# EAGLE design SKAARDUINO_v3.1_bottom (EAGLE 7.5.0)
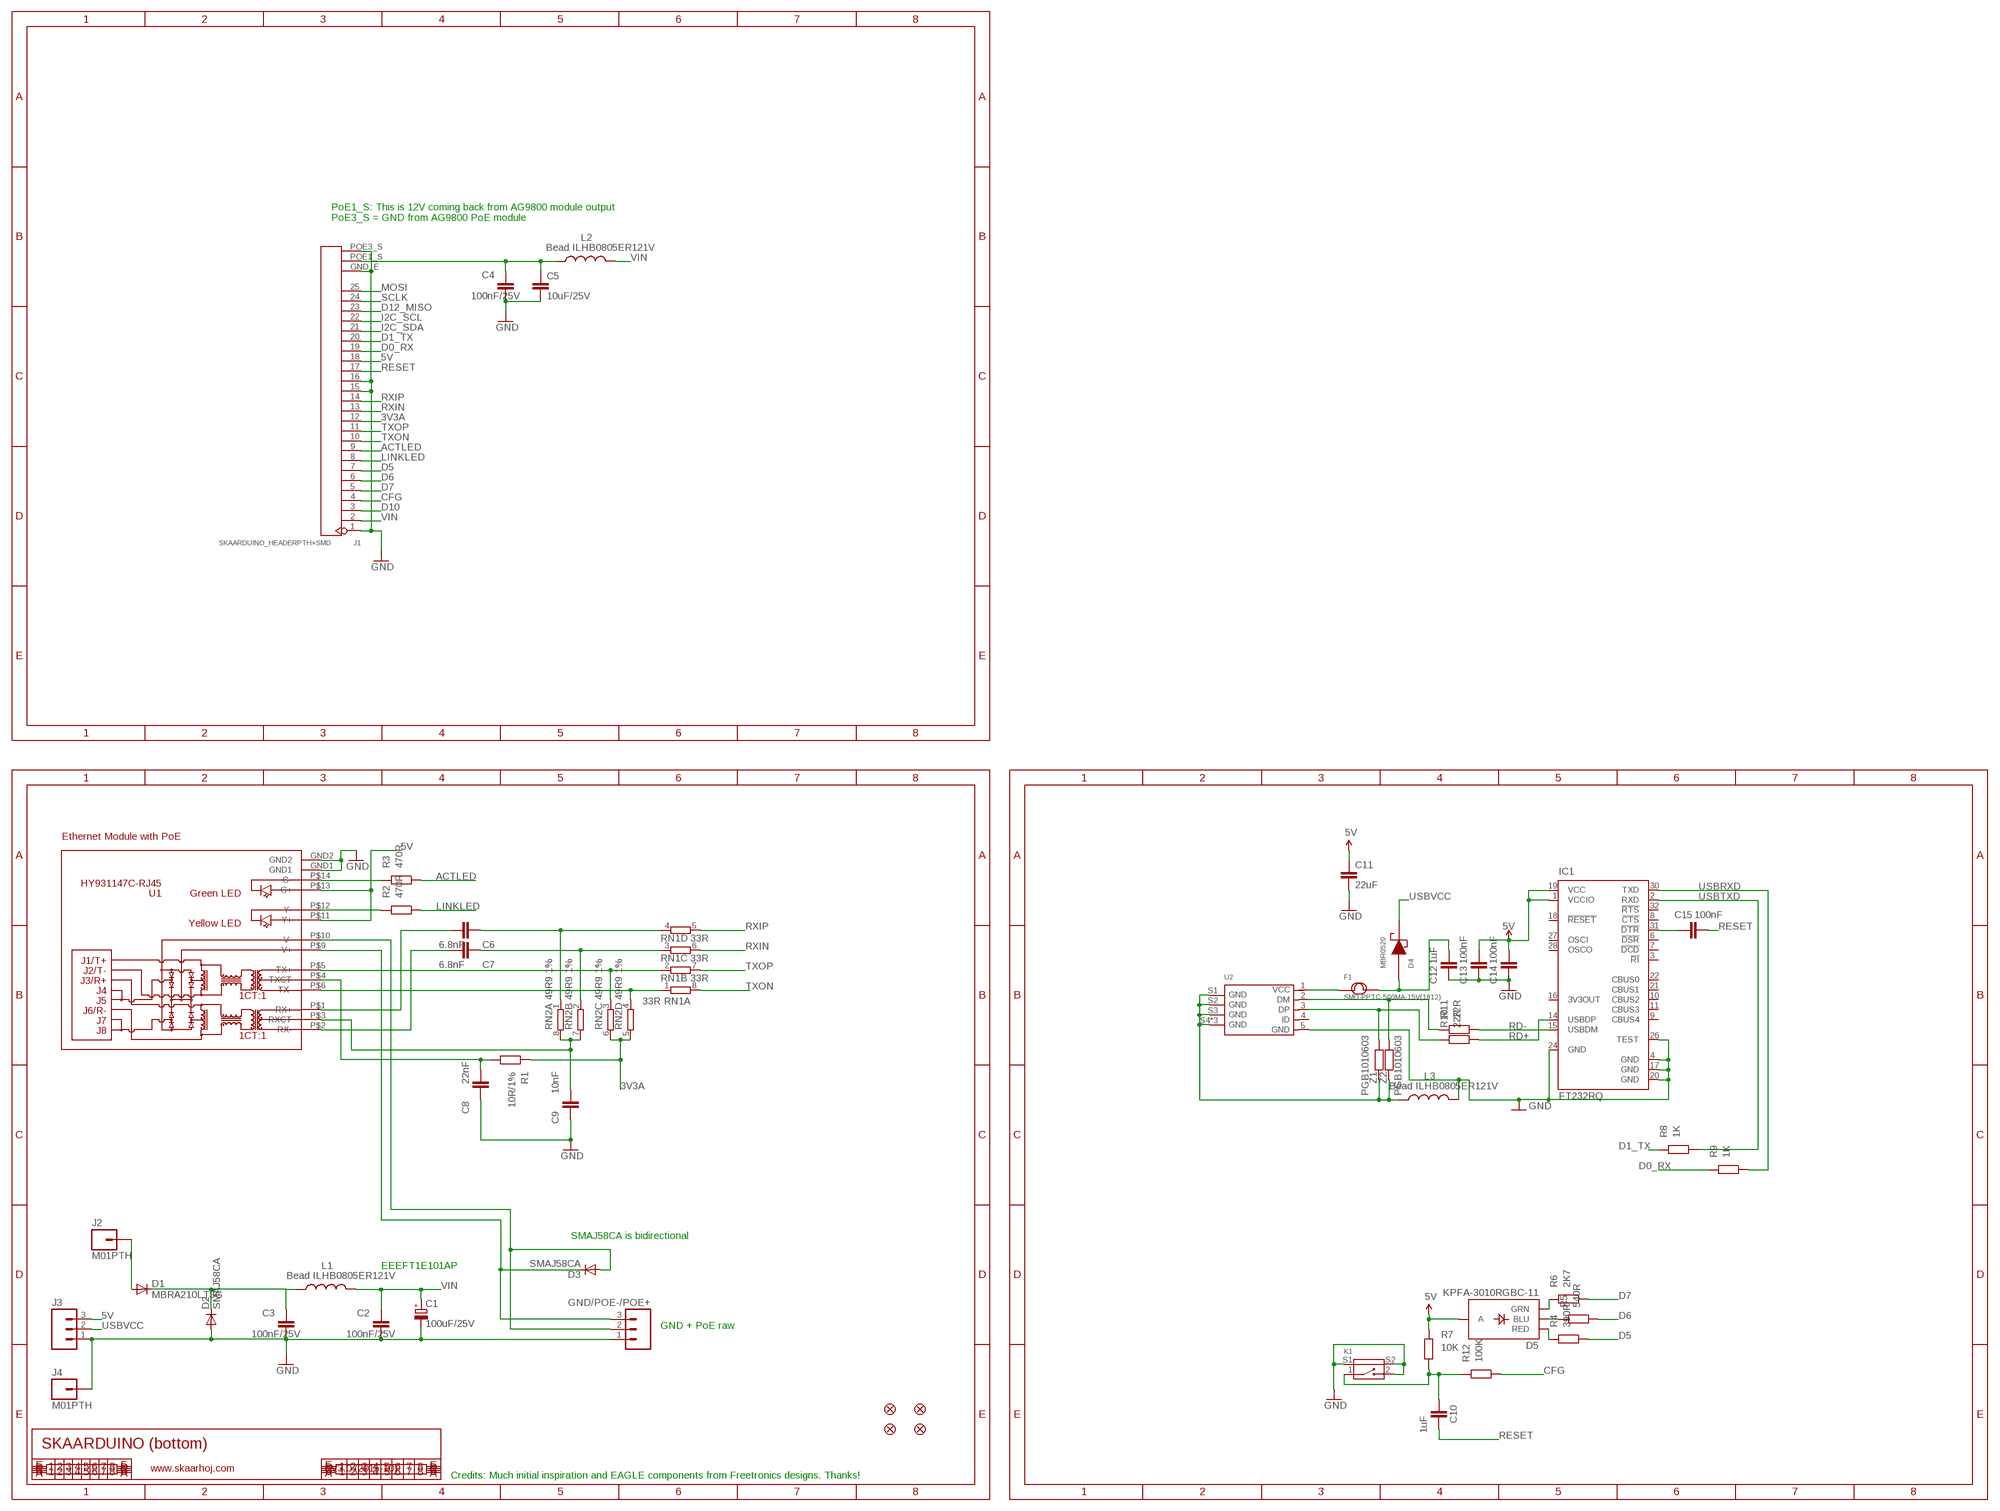
[diagram p0: schematic, sheet 1]

## Parts
C1  100uF/25V  CPOL-EUD  [PANASONIC_D]
C2  100nF/25V  CAP0402  [C0402]
C3  100nF/25V  CAP0402  [C0402]
C4  100nF/25V  CAP0402  [C0402]
C5  10uF/25V  CAP0805  [0805]
C6  6.8nF  C-EU0402C  [0402C]
C7  6.8nF  C-EU0402C  [0402C]
C8  22nF  C-EU0402C  [0402C]
C9  10nF  C-EU0402C  [0402C]
C10  1uF  C-EU0402C  [0402C]
C11  22uF  CAP0805  [0805]
C12  1uF  C-EU0402C  [0402C]
C13  100nF  C-EU0402C  [0402C]
C14  100nF  C-EU0402C  [0402C]
C15  100nF  C-EU0402C  [0402C]
D1  MBRA210LT3G  DIODESMA  [SMA-DIODE]
D2  SMAJ58CA  DIODESMA  [SMA-DIODE]
D3  SMAJ58CA  DIODESMA  [SMA-DIODE]
D4  MBR0520  [SOD-123]
D5  KPFA-3010RGBC-11  LED-TRICOLOR  [LED-TRICOLOR-SMD]
F1  SMD-PPTC-500MA-15V(1812)  [F1812]
FID1  FIDUCIAL1X2.5  [FIDUCIAL-1X2.5]
FID2  FIDUCIAL1X2.5  [FIDUCIAL-1X2.5]
FID3  FIDUCIAL1X2.5  [FIDUCIAL-1X2.5]
FID4  FIDUCIAL1X2.5  [FIDUCIAL-1X2.5]
GND/POE-/POE+  M03LOCK  [1X03_LOCK]
IC1  FT232RQ  [QFN32]
J1  SKAARDUINO_HEADERPTH+SMD  [SKAARDUINO_PTH_SMD_HEADER]
J2  M01PTH  [1X01]
J3  M03LOCK  [1X03_LOCK]
J4  M01PTH  [1X01]
K1  SMD-BUTTON-2+2P  [SW4-SMD-7.0X3.5X3.5MM-90D]
L1  Bead ILHB0805ER121V  L-USL2012C  [L2012C]
L2  Bead ILHB0805ER121V  L-USL2012C  [L2012C]
L3  Bead ILHB0805ER121V  L-USL2012C  [L2012C]
R1  10R/1%  RESISTOR0402  [0402]
R2  470R  RESISTOR0402  [0402]
R3  470R  RESISTOR0402  [0402]
R4  390R  RESISTOR0402  [0402]
R5  540R  RESISTOR0402  [0402]
R6  2K7  RESISTOR0402  [0402]
R7  10K  RESISTOR0402  [0402]
R8  1K  RESISTOR0402  [0402]
R9  1K  RESISTOR0402  [0402]
R10  22R  RESISTOR0402  [0402]
R11  22R  RESISTOR0402  [0402]
R12  100K  RESISTOR0402  [0402]
RN1  33R  4R-NCAY16  [CAY16]
RN2  49R9 1%  4R-NCAY16  [CAY16]
U1  HY931147C-RJ45  [HY931147C]
U2  MICRO-USB-SMD-B-WITHOUT-POST-W/P(ST-USB-001G)  [MICRO-USB5+4P-SMD-0.65-B]
Z1  PGB1010603  RESISTOR0402  [C0402]
Z2  PGB1010603  RESISTOR0402  [C0402]

## Nets
3V3A: J1.12 R1.2 RN2.5 RN2.6
5V [power]: C11.1 C13.2 C14.2 D5.A IC1.1(VCCIO) IC1.19(VCC) J1.18 J3.3 R7.2 U1.P$11(Y+) U1.P$13(G+)
ACTLED: J1.9 R3.1
CFG: J1.4 R12.1
CFGSW: C10.2 K1.1 R7.1 R12.2
D0_RX: J1.19 R9.2
D1_TX: J1.20 R8.2
D5: J1.7 R4.1
D6: J1.6 R5.1
D7: J1.5 R6.1
D10: J1.3
D12_MISO: J1.23
GND [power]: C1.- C2.2 C3.2 C4.2 C5.2 C8.1 C9.1 C11.2 C12.1 C13.1 C14.1 D2.A GND/POE-/POE+.1 IC1.4(GND) IC1.17(GND) IC1.20(GND) IC1.24(GND) IC1.26(TEST) J1.1 J1.15 J1.16 J1.GND_E J1.POE3_S J3.1 J4.1 K1.2 K1.S1 K1.S2 L3.2 U1.GND1 U1.GND2 U2.5(GND)
I2C_SCL: J1.22
I2C_SDA: J1.21
LINKLED: J1.8 R2.1
MOSI: J1.25
N$1: C8.2 R1.1 U1.P$4(TXCT)
N$2 [VIN]: C4.1 C5.1 J1.POE1_S L2.1
N$3 [VIN]: D3.C GND/POE-/POE+.3 U1.P$9(V+)
N$4 [VIN]: C3.1 D1.C D2.C L1.1
N$5 [VIN]: D3.A GND/POE-/POE+.2 U1.P$10(V-)
N$6 [VIN]: C12.2 D4.2(AN) F1.2
N$7 [VIN]: F1.1 U2.1(VCC)
N$9: C7.2 U1.P$2(RX-)
N$10: D5.G(GRN) R6.2
N$11: C6.2 U1.P$1(RX+)
N$13 [VIN]: D1.A J2.1
N$14: D5.B(BLU) R5.2
N$15: D5.R(RED) R4.2
N$16: R10.2 U2.3(DP) Z1.1
N$17: R11.2 U2.2(DM) Z2.1
N$18: C15.1 IC1.31(!DTR)
N$21: L3.1 U2.S1(GND) U2.S2(GND) U2.S3(GND) U2.S4(GND) U2.S5(GND) U2.S6(GND) Z1.2 Z2.2
N$67: R3.2 U1.P$14(G-)
N$321: C9.2 RN2.7 RN2.8 U1.P$3(RXCT)
N$332: R2.2 U1.P$12(Y-)
RD+: IC1.14(USBDP) R10.1
RD-: IC1.15(USBDM) R11.1
RESET: C10.1 C15.2 J1.17
RXIN: J1.13 RN1.6
RXIN_E: C7.1 RN1.3 RN2.2
RXIP: J1.14 RN1.5
RXIP_E: C6.1 RN1.4 RN2.1
SCLK: J1.24
TXON: J1.10 RN1.8
TXON_E: RN1.1 RN2.4 U1.P$6(TX-)
TXOP: J1.11 RN1.7
TXOP_E: RN1.2 RN2.3 U1.P$5(TX+)
USBRXD: IC1.30(TXD) R9.1
USBTXD: IC1.2(RXD) R8.1
USBVCC [VIN]: D4.1(CA) J3.2
VIN [VIN]: C1.+ C2.1 J1.2 L1.2 L2.2
Unconnected: IC1.3(!RI) IC1.6(!DSR) IC1.7(!DCD) IC1.8(!CTS) IC1.9(CBUS4) IC1.10(CBUS2) IC1.11(CBUS3) IC1.16(3V3OUT) IC1.18(!RESET) IC1.21(CBUS1) IC1.22(CBUS0) IC1.27(OSCI) IC1.28(OSCO) IC1.32(!RTS) U2.4(ID)

## Notes on the sheet
- PoE1_S: This is 12V coming back from AG9800 module output
  PoE3_S = GND from AG9800 PoE module
- Ethernet Module with PoE
- SMAJ58CA is bidirectional
- EEEFT1E101AP
- GND + PoE raw
- SKAARDUINO (bottom)
- www.skaarhoj.com | V3.0 (2015-10)
- Credits: Much initial inspiration and EAGLE components from Freetronics designs. Thanks!

## Library data of the parts
C1 = rcl:CPOL-EU: POLARIZED CAPACITOR, European symbol
C2-C4 = freetronics:CAP: Capacitor Standard 0603 ceramic capacitor, and 0.1" leaded capacitor.
C5 C11 = SparkFun:CAP: Capacitor Standard 0603 ceramic capacitor, and 0.1" leaded capacitor.
C6-C10 C12-C15 = freetronics-jon:C-EU: CAPACITOR, European symbol
D1-D3 = SparkFun:DIODE: Diode These are standard reverse protection diodes and small signal diodes. SMA package can handle up to about 1A. SOD-323 can handle about 200mA. What the SOD-323 package when ordering, there are some mfgs out there that are 5-pin packages.
D4 = MySMD:MBR0520
D5 = SKAARHOJ:LED-TRICOLOR: Tri-Color LED SMD Proven layout and schematic for triple color LED in SMD package - common anode. Spark Fun Electronics SKU : COM-07844
F1 = Seeed-OPL-fuse:SMD-PPTC-500MA-15V(1812): 307010007
FID1-FID4 = freetronics:FIDUCIAL: Fiducial Alignment Points Various fiducial points for machine vision alignment.
GND/POE-/POE+ J3 = SparkFun:M03: Header 3 Standard 3-pin 0.1" header. Use with straight break away headers (SKU : PRT-00116), right angle break away headers (PRT-00553), swiss pins (PRT-00743), machine pins (PRT-00117), and female headers (PRT-00115). Molex polarized connector foot print use with SKU : PRT-08232 with associated crimp pins and housings.
IC1 = ftdichip:FT232R: Source: http://www.ftdichip.com/Documents/DataSheets/DS_FT232R_v104.pdf; MPN: FT232RQ; OC_FARNELL: 1146033; OC_NEWARK: 91K9919
J1 = SKAARHOJ:SKAARDUINO_HEADER
J2 J4 = SparkFun:M01: Header 1 Standard 1-pin 0.1" header. Use with straight break away headers (SKU : PRT-00116), right angle break away headers (PRT-00553), swiss pins (PRT-00743), machine pins (PRT-00117), and female headers (PRT-00115).
K1 = Seeed-OPL-Button:SMD-BUTTON-2+2P: 311020023; MPN: TS-1188E
L1-L3 = rcl:L-US: INDUCTOR, American symbol
R1-R12 = freetronics-jon:RESISTOR: Resistor Basic schematic elements and footprints for 0603, 1206, and PTH 1/10th watt (small) resistors.
RN1 RN2 = freetronics-master-v1:4R-N: Array Chip Resistor Source: RS Component / Phycomp
U1 = freetronics-jon:HY931147C
U2 = Seeed-OPL-Connector:MICRO-USB-SMD-B-WITHOUT-POST-W/P(ST-USB-001G): 320010000; MPN: ST-USB-001G
Z1 Z2 = freetronics:RESISTOR: Resistor Basic schematic elements and footprints for 0603, 1206, and PTH 1/10th watt (small) resistors.

## Net classes
0 default: width 0.203 mm, clearance 0.127 mm
1 power: width 0.203 mm, clearance 0.127 mm
2 VIN: width 0.406 mm, clearance 0.61 mm

## Board
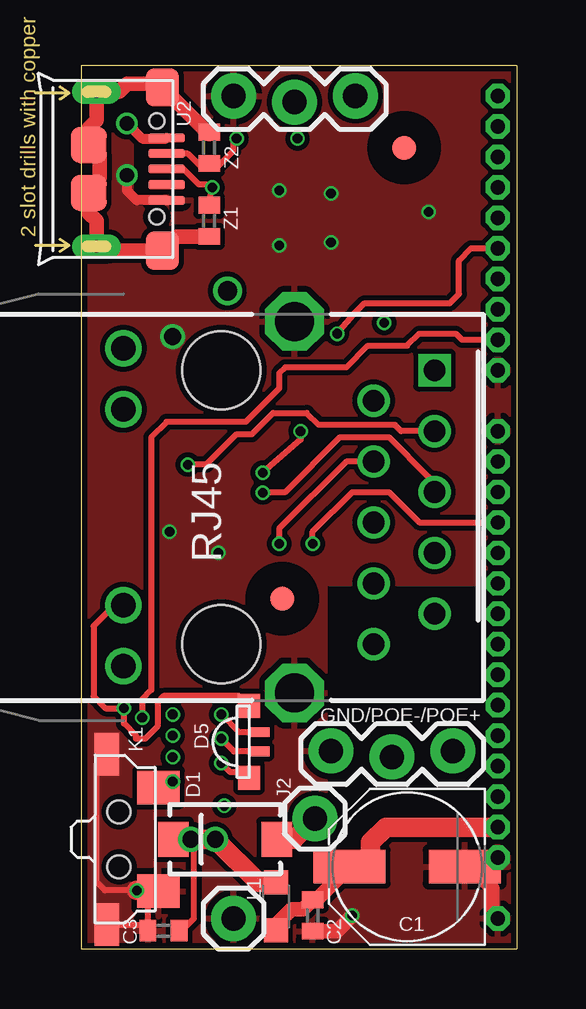
[diagram p1: board, top side]
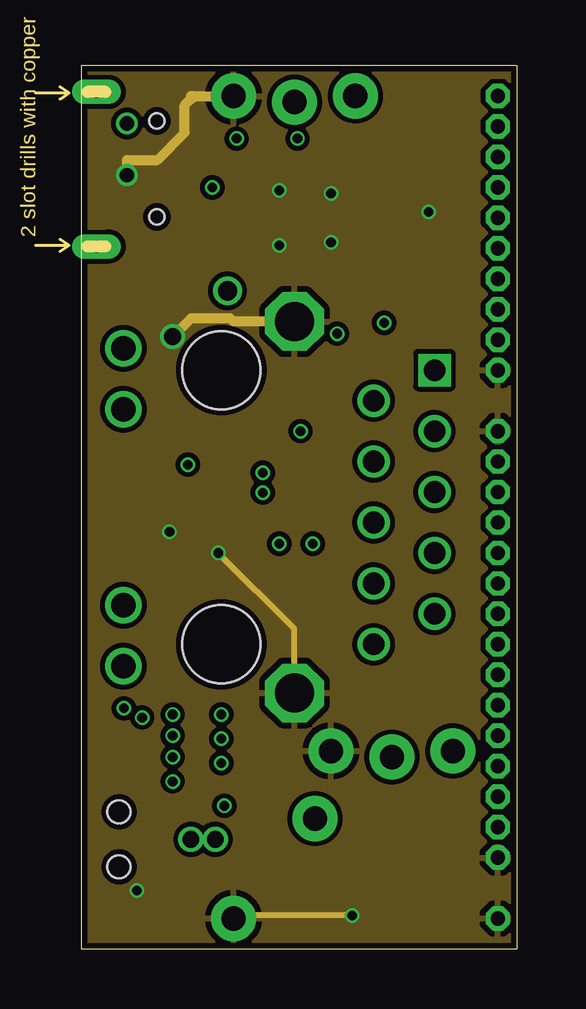
[diagram p2: board, inner layer GND]
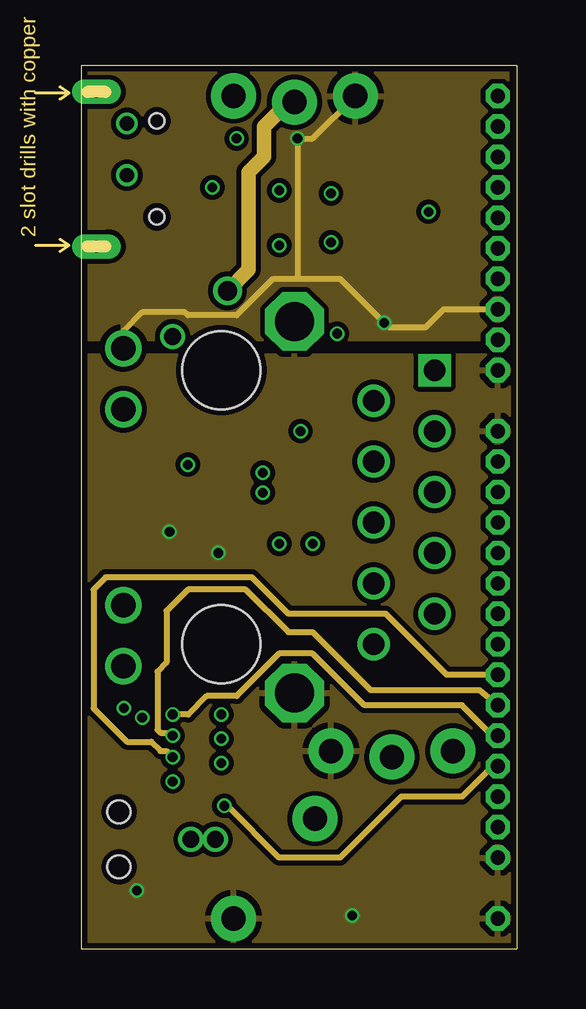
[diagram p3: board, inner layer 5V]
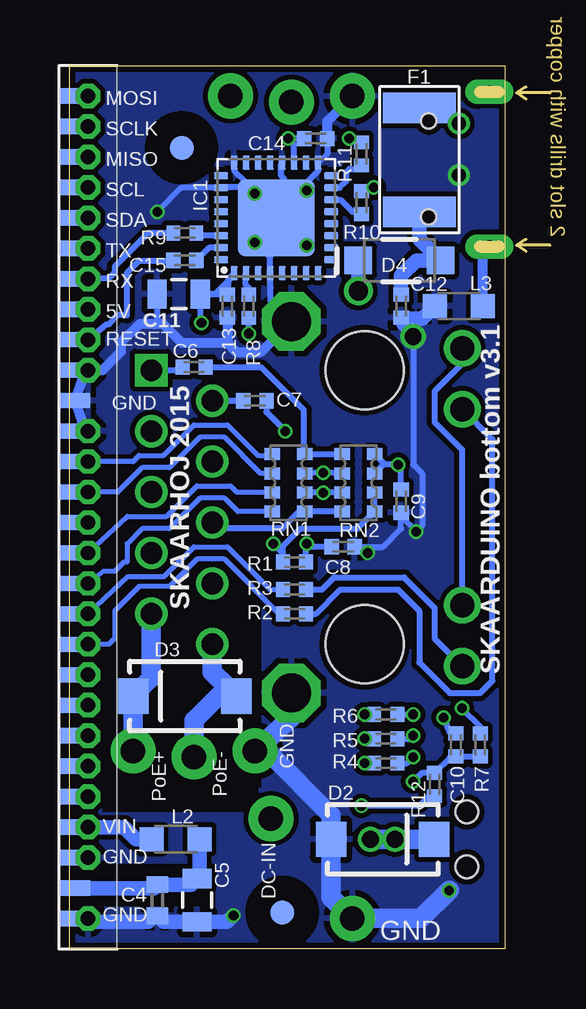
[diagram p4: board, bottom side, seen from below]

Size 18.16 x 36.83 mm. Coordinates in mm from the lower left corner, seen from the top.
Outline: 0,0 18.16,0 18.16,36.83 0,36.83 0,0
Copper layers (1*2*15*16): Top 0.035mm / dielectric 0.2mm / GND 0.0175mm / dielectric 0.3mm / 5V 0.0175mm / dielectric 0.2mm / Bottom 0.035mm
Design rules "SeeedStudio_4layer_DRU_no_angle_20140221 *": minimum track width 8mil, minimum drill 12mil, track to track 8mil, track to pad 8mil, pad to pad 8mil, via to via 8mil, smd to smd 0mil, copper to edge 10mil, drill to drill 8mil, minimum pad ring 6mil, minimum via ring 4mil, stop-mask expansion 4mil, vias tented up to drill 100mil, thermal gap 10mil
tRestrict: area 7.4,13.6 to 9.4,15.6; area 12.4,32.4 to 14.5,34.4; area 10.3,5.8 to 18.2,15.1
bRestrict: area 12.4,32.4 to 14.5,34.4; area 8.3,0.5 to 10.3,2.5; area 12.1,1.8 to 18,3.6; area 10.2,6.7 to 16.8,14.9; area 10.3,5.7 to 16.8,6.9
vRestrict: area 10.2,5.8 to 18,15.1

### Footprints (pad centres in the part's own frame; a part is rotated, then mirrored left to right if it is on the bottom)
PANASONIC_D = smd 3 x 1.4: + 2.4,0; - -2.4,0
C0402 = smd 0.7 x 0.9: 1 -0.65,0; 2 0.65,0
0805 = smd 0.8 x 1.2: 1 -0.9,0; 2 0.9,0
0402C = smd 0.59 x 0.64: 1 -0.48,0; 2 0.48,0
SMA-DIODE = smd 1.27 x 1.47: A -2.15,0; C 2.15,0
SOD-123 = smd 1.143 x 1.143: 1 0,0; 2 3.429,0
LED-TRICOLOR-SMD = smd 1 x 0.9: A -1.5,0; R 1.5,0 | smd 0.4 x 0.8: B 0.4,0.45; G -0.4,0.45
F1812 = smd 1.27 x 3.048: 1 -2.159,0; 2 2.159,0
FIDUCIAL-1X2.5 = smd 1 x 1: 1 0,0
1X03_LOCK = drill 1.016 pad 1.88: 1 0,0.127; 2 2.54,-0.127; 3 5.08,0.127
QFN32 = smd 0.6 x 0.3: 1 -2.3,1.75; 2 -2.3,1.25; 3 -2.3,0.75; 4 -2.3,0.25; 5 -2.3,-0.25; 6 -2.3,-0.75; 7 -2.3,-1.25; 8 -2.3,-1.75; 17 2.3,-1.75; 18 2.3,-1.25; 19 2.3,-0.75; 20 2.3,-0.25; 21 2.3,0.25; 22 2.3,0.75; 23 2.3,1.25; 24 2.3,1.75 | smd 0.3 x 0.6: 9 -1.75,-2.3; 10 -1.25,-2.3; 11 -0.75,-2.3; 12 -0.25,-2.3; 13 0.25,-2.3; 14 0.75,-2.3; 15 1.25,-2.3; 16 1.75,-2.3; 25 1.75,2.3; 26 1.25,2.3; 27 0.75,2.3; 28 0.25,2.3; 29 -0.25,2.3; 30 -0.75,2.3; 31 -1.25,2.3; 32 -1.75,2.3 | smd 3.2 x 3.2: EXP 0,0
SKAARDUINO_PTH_SMD_HEADER = drill 0.6 pad 1.016 octagon: 1 0.79,3.81; 2 0.79,5.08; 3 0.79,6.35; 4 0.79,7.62; 5 0.79,8.89; 6 0.79,10.16; 7 0.79,11.43; 8 0.79,12.7; 9 0.79,13.97; 10 0.79,15.24; 11 0.79,16.51; 12 0.79,17.78; 13 0.79,19.05; 14 0.79,20.32; 15 0.79,21.59; 16 0.79,24.13; 17 0.79,25.4; 18 0.79,26.67; 19 0.79,27.94; 20 0.79,29.21; 21 0.79,30.48; 22 0.79,31.75; 23 0.79,33.02; 24 0.79,34.29; 25 0.79,35.56; GND_E 0.79,1.27 | smd 1.27 x 0.635: GND_E2 0.254,1.27; P$1 0.254,3.81; P$2 0.254,5.08; P$3 0.254,6.35; P$4 0.254,7.62; P$5 0.254,8.89; P$6 0.254,10.16; P$7 0.254,11.43; P$8 0.254,12.7; P$9 0.254,13.97; P$10 0.254,15.24; P$11 0.254,16.51; P$12 0.254,17.78; P$13 0.254,19.05; P$14 0.254,20.32; P$15 0.254,21.59; P$16 0.254,24.13; P$17 0.254,25.4; P$18 0.254,26.67; P$19 0.254,27.94; P$20 0.254,29.21; P$21 0.254,30.48; P$22 0.254,31.75; P$23 0.254,33.02; P$24 0.254,34.29; P$25 0.254,35.56; POE1_S 0.254,2.54; POE3_S 0.254,22.86
1X01 = drill 1.016 pad 1.88: 1 0,0
SW4-SMD-7.0X3.5X3.5MM-90D = smd 1.397 x 1.778: 1 -2.159,1.651; 2 2.159,1.651 | smd 1.778 x 1.016: S1 -3.556,-0.508; S2 3.556,-0.508 | hole 0.95: -1.15,0; 1.15,0
L2012C = smd 1 x 1: 1 -1,0; 2 1,0
0402 = smd 0.571 x 0.62: 1 -0.48,0; 2 0.48,0
CAY16 = smd 0.5 x 0.65: 1 -1.2,-0.675; 2 -0.4,-0.675; 3 0.4,-0.675; 4 1.2,-0.675; 5 1.2,0.675; 6 0.4,0.675; 7 -0.4,0.675; 8 -1.2,0.675
HY931147C = drill 1.63 octagon: GND1 3.05,7.745; GND2 3.05,-7.745 | drill 0.9 square: P$1 8.89,5.715 | drill 0.9: P$2 6.35,4.445; P$3 8.89,3.175; P$4 6.35,1.905; P$5 8.89,0.635; P$6 6.35,-0.635; P$7 8.89,-1.905; P$8 6.35,-3.175; P$9 8.89,-4.445; P$10 6.35,-5.715 | drill 1.016: P$11 -4.08,6.625; P$12 -4.08,4.085; P$13 -4.08,-4.085; P$14 -4.08,-6.625 | hole 3.25: 0,5.715; 0,-5.715
MICRO-USB5+4P-SMD-0.65-B = smd 0.381 x 1.524: 1 -1.3,-0.25; 2 -0.65,-0.25; 3 0,-0.25; 4 0.65,-0.25; 5 1.3,-0.25 | smd 1.6 x 1.397: S1 -3.4,-0.427; S6 3.4,-0.427 | drill 0.508 pad 1.016 long: S2 -3.226,-3.175; S5 3.226,-3.175 | smd 1.5 x 1.5: S3 -1,-3.5; S4 1,-3.5 | hole 0.635: -2,-0.65; 2,-0.65

### Placement (x,y rotation side)
C1  13.59,3.43 180 top
C2  9.65,1.4 270 top
C3  3.43,0.76 180 top
C4  14.48,2.03 270 bottom
C5  12.83,2.03 270 bottom
C6  12.95,24.26 180 bottom
C7  10.41,22.86 180 bottom
C8  6.73,16.76 180 bottom
C9  4.32,18.67 90 bottom
C10  2.03,8.51 270 bottom
C11  13.59,27.3 180 bottom
C12  4.32,26.8 90 bottom
C13  11.56,26.8 90 bottom
C14  7.87,33.78 180 bottom
C15  13.34,28.7 180 bottom
D1  6,4.57 180 top
D2  5.08,4.57 0 bottom
D3  13.34,10.54 180 bottom
D4  6.1,28.7 0 bottom
D5  7,8.64 270 top
F1  3.56,32.89 270 bottom
FID1  8.38,14.61 0 top
FID2  9.27,1.52 0 bottom
FID3  13.46,33.4 0 top
FID4  13.46,33.4 0 bottom
GND/POE-/POE+  10.41,8.13 0 top
IC1  9.53,30.48 90 bottom
J1  18.16,0 0 bottom
J2  9.74,5.44 0 top
J3  6.35,35.43 0 top
J4  6.35,1.27 0 top
K1  1.57,4.57 270 top
L1  8.13,1.78 270 top
L2  13.72,4.57 180 bottom
L3  1.91,26.8 180 bottom
R1  8.76,16.13 180 bottom
R2  8.76,13.97 0 bottom
R3  8.76,14.99 0 bottom
R4  4.95,7.75 180 bottom
R5  4.95,8.76 180 bottom
R6  4.95,9.78 180 bottom
R7  1.02,8.51 90 bottom
R8  10.67,26.8 270 bottom
R9  13.34,29.84 180 bottom
R10  5.97,31.11 90 bottom
R11  5.97,33.15 90 bottom
R12  2.92,6.86 90 bottom
RN1  9.02,19.43 90 bottom
RN2  6.1,19.43 270 bottom
U1  5.84,18.41 0 top
U2  3.81,32.51 270 top
Z1  5.33,30.35 270 top
Z2  5.33,33.4 90 top

### Tracks (layer width: path | path; a pad name or v marks a point on that pad's centre or on a via)
3V3A  (via drill 0.4)
  Top 0.254: v9.65,16.89 9.65,17.4 11.3,19.05 12.83,19.05 14.1,17.78 J1.12
  Bottom 0.254: RN2.6 RN2.5 6.13,17.53 8.51,17.53 9.24,16.79 R1.2 9.24,16.48 v9.65,16.89
5V  (via drill 0.4)
  Top 0.254: D5.A 6.59,10.54 3.43,10.54 3.17,10.29 3.17,9.27 2.67,8.76 2.29,8.76 2.29,8.89 1.78,9.4 v1.78,10.03 1.02,10.03 0.51,10.54 0.51,13.46 1.38,14.33 U1.P$13
  5V 0.254: 9.02,27.94 8,27.94 6.48,26.42 4.45,26.42 4.32,26.54 2.54,26.54 1.76,25.77 U1.P$11 | 9.02,27.94 10.79,27.94 v12.64,26.1 12.83,25.91 14.35,25.91 15.11,26.67 J1.18 | 9.02,27.94 v9.02,33.78 9.65,33.78 J3.3
  Bottom 0.254: R7.2 1.02,9.27 v1.78,10.03 | C14.2 v9.02,33.78 8.78,33.54 IC1.19 | U1.P$11 1.76,24.4 2.92,23.24 2.92,21.97 1.78,20.83 1.78,14.35 U1.P$13 | C11.1 12.66,27.28 C13.2 11.53,27.94 IC1.1 11.28,28.09 12.06,27.3 C11.1 12.7,26.16 v12.64,26.1
  pour 5V: 0,36.83 17.78,36.83 17.78,25.4 0,25.4
ACTLED
  Bottom 0.203: R3.1 9.78,14.99 11.56,16.76 12.95,16.76 14.2,15.52 15.7,15.52 J1.9
CFG  (via drill 0.4)
  5V 0.254: J1.4 17.14,7.62 15.88,6.35 13.34,6.35 10.79,3.81 8.26,3.81 6.1,5.97 v5.97,5.97
  Bottom 0.254: R12.1 3.15,6.38 3.56,5.97 v5.97,5.97
CFGSW  (via drill 0.4)
  Top 0.254: v3.81,6.99 3.48,6.99 K1.1
  Bottom 0.254: R7.1 C10.2 2.09,7.97 2.29,7.97 R12.2 3.46,7.34 v3.81,6.99
D0_RX
  Bottom 0.254: R9.2 14.86,29.84 16.26,28.45 16.26,28.19 16.51,27.94 J1.19
D1_TX  (via drill 0.4)
  Top 0.254: v10.67,25.65 11.43,26.54 11.81,26.92 15.37,26.92 15.75,27.3 15.75,28.7 16.26,29.21 J1.20
  Bottom 0.254: R8.2 v10.67,25.65
D5  (via drill 0.4)
  5V 0.254: v3.81,8 3.56,8.26 3.3,8.26 2.92,8.64 1.91,8.64 0.51,10.03 0.51,14.99 1.02,15.49 7.11,15.49 8.64,13.97 12.7,13.97 15.24,11.43 J1.7
  Bottom 0.254: R4.1 4.06,7.75 v3.81,8
D6  (via drill 0.4)
  5V 0.254: v3.81,8.89 3.68,9.02 3.3,9.02 3.17,9.14 3.17,11.56 3.56,11.94 3.56,14.1 4.45,14.99 6.86,14.99 8.64,13.21 9.65,13.21 12.06,10.79 16.61,10.79 J1.6
  Bottom 0.254: R5.1 3.94,8.76 v3.81,8.89
D7  (via drill 0.4)
  5V 0.254: v3.81,9.78 R6.1 5.24,10.54 6.48,10.54 8.26,12.32 9.65,12.32 11.81,10.16 15.88,10.16 17.14,8.89 J1.5
  Bottom 0.254: R6.1 4.35,9.65 4.35,9.75 4.32,9.78 v3.81,9.78
GND  (via drill 0.4, 0.6, 0.7)
  Top 0.254: K1.S2 2.52,1.02 C3.2 2.78,1.97 | 2.78,1.97 K1.2 | 2.78,1.97 v2.31,2.44 0.99,2.44 0.64,2.79 0.64,7.7 K1.S1
  Top 0.406: U2.5 2.32,31.21 1.91,31.62 v1.91,32.26
  Top 0.61: C2.2 10.65,0.75 v11.3,1.4 | J1.1 16.86,3.43 C1.- 16.37,3.31 17.14,2.54 17.14,1.37 J1.GND_E
  Top 0.813: v2.31,2.44 3.2,2.44 K1.2
  GND 0.254: U1.GND2 8.89,13.33 v5.71,16.51 | v11.3,1.4 6.48,1.4 J4.1
  GND 0.406: v1.91,32.26 1.91,32.89 3.17,32.89 4.32,34.04 4.32,35.18 4.7,35.56 | 4.57,35.56 4.7,35.56 | 4.7,35.56 J3.1 | U1.GND1 6.35,26.16 6.22,26.29 4.57,26.29 v3.81,25.53
  Bottom 0.254: 4.42,18.16 C9.1 | v5.71,16.51 5.71,16.74 C8.1 5.08,16.76 4.32,17.53 C9.1 | v14.48,30.73 13.48,31.73 IC1.26 11.8,31.75 10.62,31.75 | C14.1 7.39,33.16 IC1.17 7.78,32.43 8.33,31.88 | 8.33,31.88 9.17,31.88 9.2,31.9 | 9.2,31.9 9.2,32.11 9.32,32.23 9.32,32.73 IC1.20 | IC1.24 11.28,32.43 10.82,31.98 10.82,31.95 10.62,31.75 | 10.62,31.75 10.54,31.75 | 10.54,31.75 9.35,31.75 9.2,31.9 | U1.GND1 9.78,27.04 IC1.4 9.78,28.82 v10.41,29.46 v10.41,31.5 10.41,31.62 10.54,31.75 | 8.33,31.88 8.26,31.8 v8.26,31.62 v8.26,29.34 | C9.1 4.32,18.03 v3.68,17.4 3.43,17.65 3.43,19.81 3.81,20.19 v3.81,25.53 | C11.2 14.49,26.16 14.61,26.05
  Bottom 0.406: C12.1 4.32,26.04 v3.81,25.53 | C14.1 7.39,34.52 J3.1 | C13.1 11.56,25.27 | 11.56,25.27 11.18,24.89 10.16,24.89 U1.GND1 | 11.56,25.27 13.46,25.27 14.23,26.05 14.61,26.05 15.23,26.05 16,25.27 16,24.89 16.76,24.13 J1.16 17.53,23.98 J1.POE3_S 17.53,21.75 J1.15
  Bottom 0.61: v11.3,1.4 11.57,1.13 C5.2 14.23,1.13 C4.2 14.62,1.38 14.86,1.14 17.12,1.14 J1.GND_E | L3.2 2.92,26.8 3.43,26.29 4.29,26.29 C12.1
  Bottom 0.813: v2.31,2.44 3.48,1.27 J4.1 7.23,2.15 D2.A 7.23,5.58 9.78,8.13 GND/POE-/POE+.1 8.89,9.65 U1.GND2
  pour Bottom: 0,0 18.41,0 18.41,36.83 0,36.83
  pour GND: 0,0 18.41,0 18.41,36.83 0,36.83
  pour Top: 0,0 18.41,0 18.41,36.83 0,36.83
  pour 5V: 0,0 18.41,0 18.41,24.77 0,24.77
LINKLED
  Bottom 0.203: R2.1 9.4,13.97 11.68,16.26 12.83,16.26 13.97,15.11 15.24,15.11 16.26,14.1 16.26,12.95 16.51,12.7 J1.8
N$1  (via drill 0.4)
  Top 0.254: U1.P$4 11.05,20.32 8.26,17.53 v8.26,16.89
  Bottom 0.254: C8.2 8.13,16.76 v8.26,16.89 8.28,16.86 R1.1
N$2
  Bottom 0.61: J1.POE1_S 14.62,2.54 C4.1 13.08,2.68 C5.1 12.72,3.04 L2.1
N$3
  Bottom 0.813: U1.P$9 14.73,11.29 D3.C GND/POE-/POE+.3
N$4  (via drill 0.7)
  Top 0.254: C3.1 4.08,0.65 4.7,1.27 4.7,4.19 5.08,4.57
  Top 0.813: L1.1 7.38,2.78 v5.59,4.57 5.08,4.57 v4.57,4.57 D1.C
  Bottom 0.813: D2.C v4.57,4.57 v5.59,4.57
N$5
  Bottom 0.813: U1.P$10 12.19,11.55 11.56,10.92 | 11.56,10.92 D3.A | GND/POE-/POE+.2 12.95,9.53 11.56,10.92
N$6
  Bottom 0.61: F1.2 3.56,29.59 D4.2 3.68,28.7 4.32,28.07 C12.2
N$7  (via drill 0.6)
  Top 0.406: v1.91,34.42 2.54,33.78 3.53,33.78 U2.1
  Bottom 0.406: F1.1 2.54,35.05 v1.91,34.42
N$9
  Bottom 0.254: U1.P$2 C7.2
N$10  (via drill 0.4)
  Top 0.254: D5.G 6.58,9.04 v5.84,9.78
  Bottom 0.254: R6.2 v5.84,9.78
N$11
  Bottom 0.254: U1.P$1 13.56,24.13 C6.2
N$13
  Top 0.813: D1.A 8.88,4.57 J2.1
N$14  (via drill 0.4)
  Top 0.254: D5.B 6.37,8.24 v5.84,8.76
  Bottom 0.254: R5.2 v5.84,8.76
N$15  (via drill 0.4)
  Top 0.254: D5.R 6.71,7.14 6.48,7.37 6.22,7.37 v5.84,7.75
  Bottom 0.254: R4.2 v5.84,7.75 5.97,7.62
N$16  (via drill 0.4)
  Top 0.254: Z1.1 v5.46,31.75 5.33,31.88 4.9,31.88 4.27,32.51 U2.3
  Bottom 0.254: v5.46,31.75 5.94,31.62 R10.2
N$17  (via drill 0.4)
  Top 0.254: U2.2 3.58,33.15 4.45,33.15 4.97,32.62 Z2.1 5.7,32.62 6.35,33.27 6.35,33.66 v6.48,33.78
  Bottom 0.254: v6.48,33.78 6.12,33.78 R11.2
N$18
  Bottom 0.254: IC1.31 12.33,29.23 C15.1
N$21
  Top 0.61: Z1.2 3.97,29.7 U2.S6 0.81,29.11 U2.S5 0.64,30.35 0.31,30.68 U2.S4 0.31,31.68 0.76,32.13 0.76,33.06 U2.S3 0.31,34.22 0.64,34.54 U2.S2 1.57,35.74 1.91,36.07 3.23,36.07 U2.S1 5.33,33.96 Z2.2
  Bottom 0.406: L3.1 0.91,29.02 U2.S5
N$67
  Bottom 0.254: R3.2 7.62,14.99 7.11,15.49 4.19,15.49 2.92,14.22 2.92,12.95 U1.P$14
N$321  (via drill 0.4)
  Top 0.254: U1.P$3 13.34,21.59 13.08,21.84 9.91,21.84 9.4,22.35 8,22.35 7.11,21.46 6.48,21.46 5.21,20.19 v4.45,20.19
  Bottom 0.254: 5.06,20.19 v4.45,20.19 4.32,20.07 C9.2 | 5.06,20.19 RN2.7 | 5.06,20.19 5.06,20.27 RN2.8
N$332
  Bottom 0.254: R2.2 7.87,13.97 6.86,14.99 4.45,14.99 3.56,14.1 3.56,11.94 2.29,10.67 1.02,10.67 0.51,11.18 0.51,21.25 U1.P$12
RD+
  Bottom 0.254: IC1.14 6.85,31.23 6.35,30.73 6.07,30.73 R10.1
RD-
  Bottom 0.254: IC1.15 6.88,31.73 6.6,32 6.6,32.38 6.48,32.51 6.12,32.51 R11.1
RESET  (via drill 0.4)
  Top 0.254: v2.54,9.65 2.54,10.41 2.92,10.79 2.92,21.34 3.56,21.97 6.86,21.97 8.26,23.37 8.26,24 8.51,24.26 11.05,24.26 11.94,25.15 13.59,25.15 14.1,25.65 15.62,25.65 15.88,25.4 J1.17
  Bottom 0.254: C10.1 2.26,8.99 v2.54,9.65 | C15.2 15.24,28.7 15.75,28.19 15.75,26.42 16.13,26.42 16.51,26.04 16.61,26.04 J1.17
RXIN
  Bottom 0.203: RN1.6 10.18,19.83 11.68,21.34 12.7,21.34 13.97,20.07 15.11,20.07 16.13,19.05 J1.13
RXIN_E  (via drill 0.4)
  Top 0.254: v9.14,21.59 9.14,21.23 v7.57,19.86
  Bottom 0.254: RN2.2 v7.57,19.86 RN1.3 | C7.1 9.93,22.38 v9.14,21.59
RXIP
  Bottom 0.203: RN1.5 9.75,20.57 10.29,20.57 11.56,21.84 12.95,21.84 14.22,20.57 15.24,20.57 15.49,20.32 J1.14
RXIP_E
  Bottom 0.254: C6.1 10.16,24.26 8.38,22.48 8.38,20.67 RN1.4 RN2.1
TXON
  Bottom 0.203: RN1.8 11.12,18.23 11.68,18.8 12.7,18.8 13.97,17.53 15.11,17.53 15.75,16.89 15.75,16.13 15.88,16.13 16.26,15.75 16.74,15.75 J1.10
TXON_E
  Bottom 0.254: RN2.4 RN1.1 8.57,18.23 9.27,17.53 11.94,17.53 U1.P$6
TXOP
  Bottom 0.203: RN1.7 9.71,19.05 11.18,19.05 11.43,19.3 12.83,19.3 14.1,18.03 15.72,18.03 J1.11
TXOP_E  (via drill 0.4)
  Top 0.254: v7.57,19.02 v7.58,19.03 8.49,19.03 10.79,21.34 12.83,21.34 14.48,19.68 14.48,19.3 U1.P$5
  Bottom 0.254: RN2.3 7.75,19.03 | 7.75,19.03 RN1.2 | v7.57,19.02 7.57,18.85 7.75,19.03
USBRXD
  Bottom 0.254: IC1.30 12.74,29.73 R9.1
USBTXD
  Bottom 0.254: R8.1 10.54,27.43 10.79,27.69 10.79,28.16 IC1.2
USBVCC  (via drill 0.8)
  5V 0.61: J3.2 8.64,35.31 7.62,34.29 7.62,33.02 6.99,32.38 6.99,28.32 v6.1,27.43
  Bottom 0.61: v6.1,27.43 D4.1
VIN
  Top 0.61: L1.2 8.13,1.02 8.76,1.65 9.26,1.65 C2.1 9.81,2.05 C1.+
  Top 0.813: 11.56,3.44 C1.+ 12.06,3.43 12.06,4.45 12.7,5.08 J1.2
  Bottom 0.61: L2.2 15.37,4.57 15.88,5.08 J1.2

### Text on the board
_bsilk: MOSI | SCLK | MISO | SCL | SDA | TX | RX | SKAARDUINO bottom v3.1 | 5V | RESET | SKAARHOJ 2015 | GND | GND | PoE- | PoE+ | VIN | DC-IN | GND | GND | GND